# EAGLE schematic texboard (EAGLE 9.5.1)
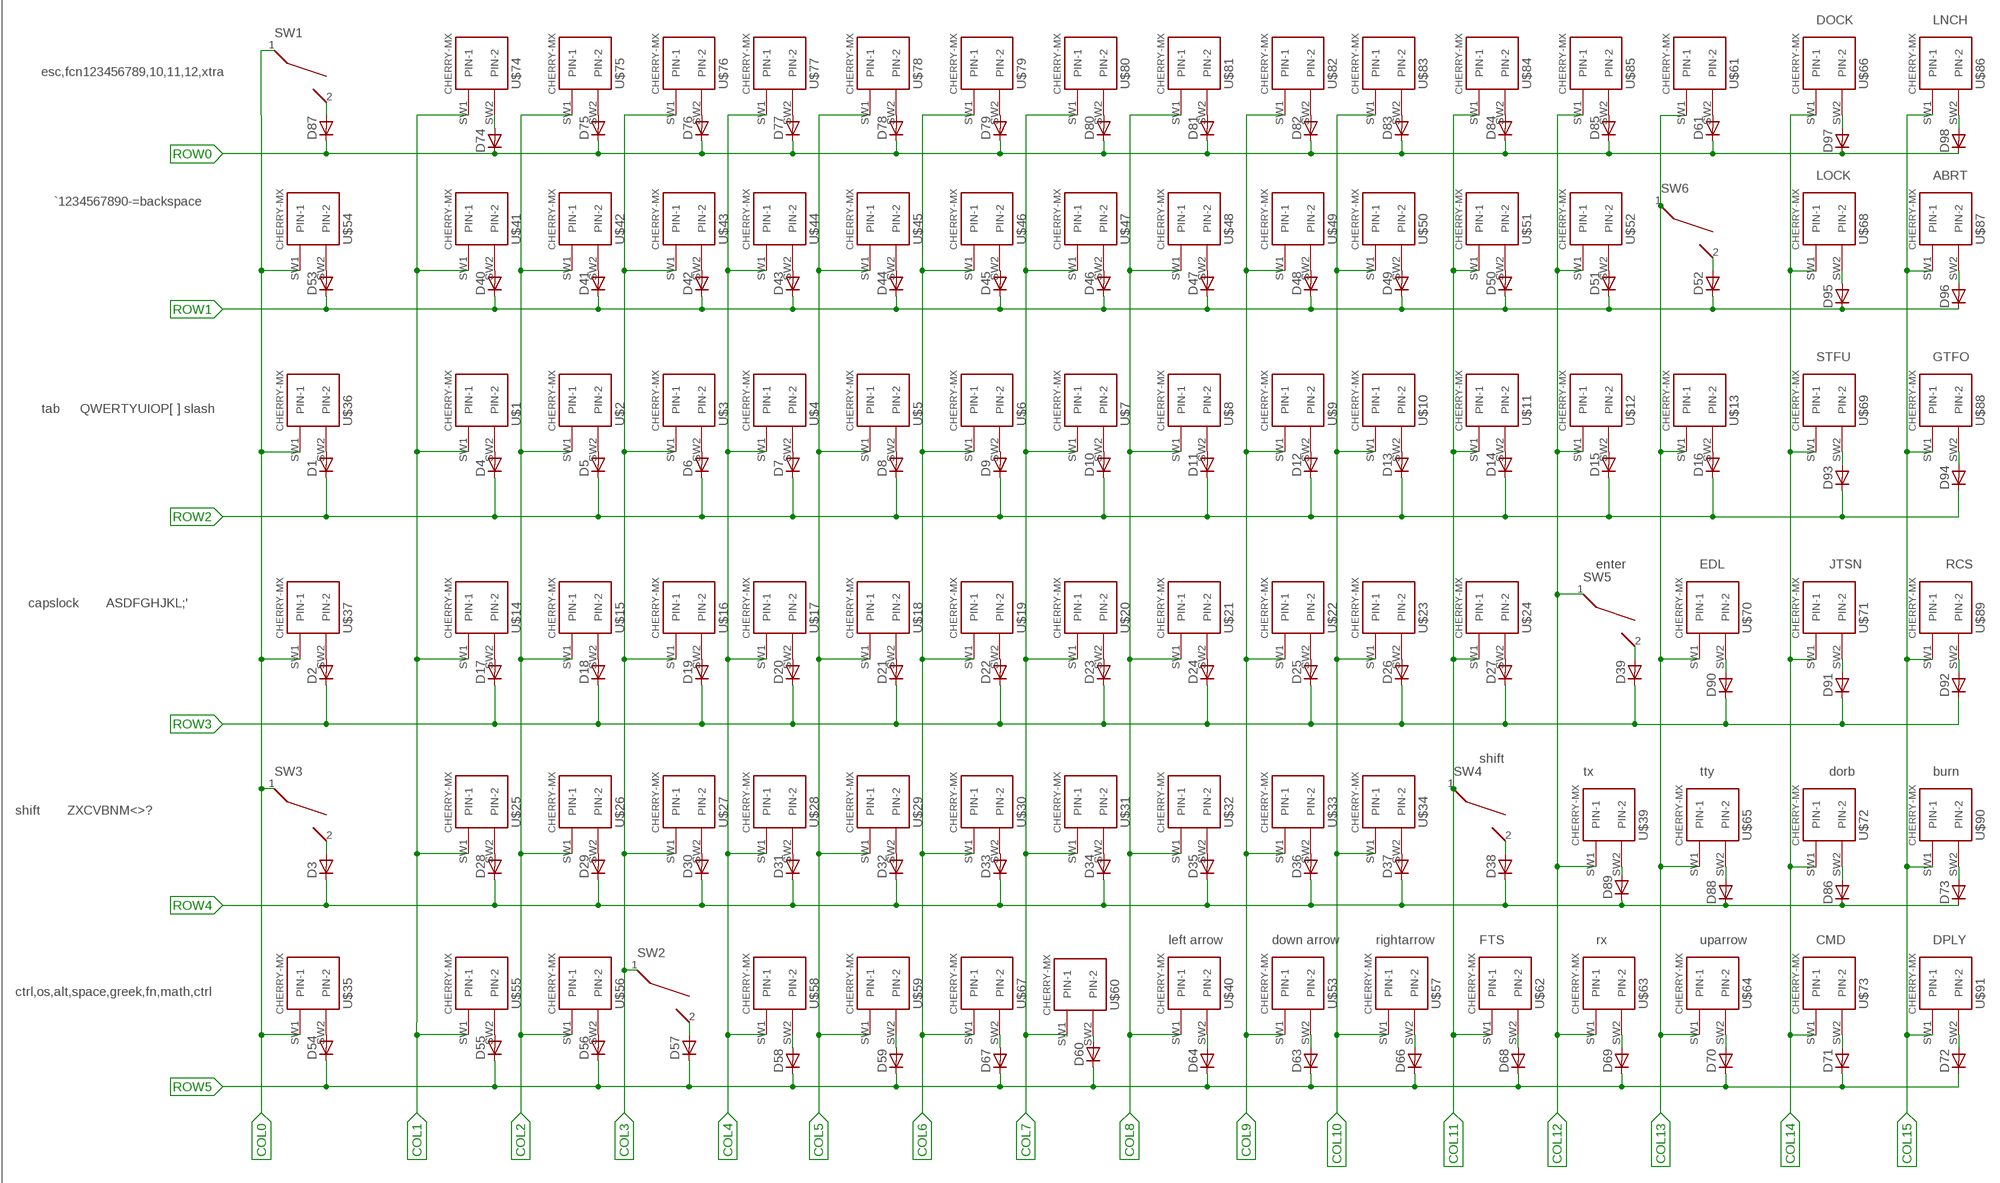
[diagram p0: schematic, sheet 1, part 1 of 2]
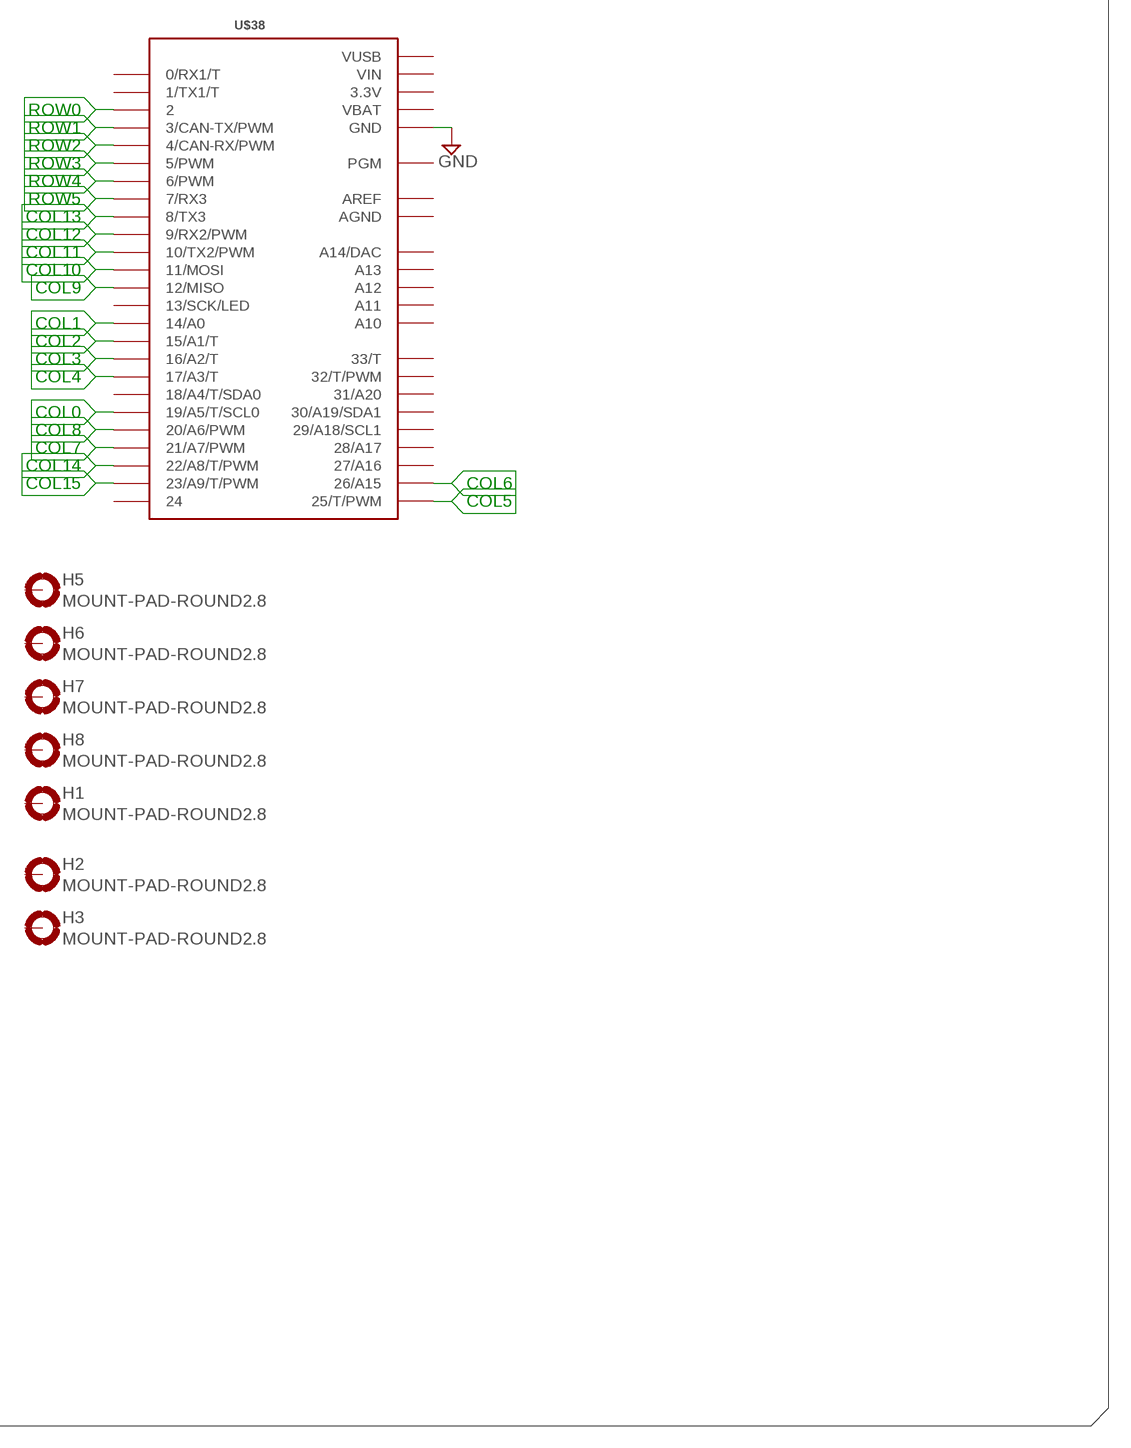
[diagram p1: schematic, sheet 1, part 2 of 2]

## Parts
D1  DIODE_E-DO35-7  [DIODE_DO35-7]
D2  DIODE_E-DO35-7  [DIODE_DO35-7]
D3  DIODE_E-DO35-7  [DIODE_DO35-7]
D4  DIODE_E-DO35-7  [DIODE_DO35-7]
D5  DIODE_E-DO35-7  [DIODE_DO35-7]
D6  DIODE_E-DO35-7  [DIODE_DO35-7]
D7  DIODE_E-DO35-7  [DIODE_DO35-7]
D8  DIODE_E-DO35-7  [DIODE_DO35-7]
D9  DIODE_E-DO35-7  [DIODE_DO35-7]
D10  DIODE_E-DO35-7  [DIODE_DO35-7]
D11  DIODE_E-DO35-7  [DIODE_DO35-7]
D12  DIODE_E-DO35-7  [DIODE_DO35-7]
D13  DIODE_E-DO35-7  [DIODE_DO35-7]
D14  DIODE_E-DO35-7  [DIODE_DO35-7]
D15  DIODE_E-DO35-7  [DIODE_DO35-7]
D16  DIODE_E-DO35-7  [DIODE_DO35-7]
D17  DIODE_E-DO35-7  [DIODE_DO35-7]
D18  DIODE_E-DO35-7  [DIODE_DO35-7]
D19  DIODE_E-DO35-7  [DIODE_DO35-7]
D20  DIODE_E-DO35-7  [DIODE_DO35-7]
D21  DIODE_E-DO35-7  [DIODE_DO35-7]
D22  DIODE_E-DO35-7  [DIODE_DO35-7]
D23  DIODE_E-DO35-7  [DIODE_DO35-7]
D24  DIODE_E-DO35-7  [DIODE_DO35-7]
D25  DIODE_E-DO35-7  [DIODE_DO35-7]
D26  DIODE_E-DO35-7  [DIODE_DO35-7]
D27  DIODE_E-DO35-7  [DIODE_DO35-7]
D28  DIODE_E-DO35-7  [DIODE_DO35-7]
D29  DIODE_E-DO35-7  [DIODE_DO35-7]
D30  DIODE_E-DO35-7  [DIODE_DO35-7]
D31  DIODE_E-DO35-7  [DIODE_DO35-7]
D32  DIODE_E-DO35-7  [DIODE_DO35-7]
D33  DIODE_E-DO35-7  [DIODE_DO35-7]
D34  DIODE_E-DO35-7  [DIODE_DO35-7]
D35  DIODE_E-DO35-7  [DIODE_DO35-7]
D36  DIODE_E-DO35-7  [DIODE_DO35-7]
D37  DIODE_E-DO35-7  [DIODE_DO35-7]
D38  DIODE_E-DO35-7  [DIODE_DO35-7]
D39  DIODE_E-DO35-7  [DIODE_DO35-7]
D40  DIODE_E-DO35-7  [DIODE_DO35-7]
D41  DIODE_E-DO35-7  [DIODE_DO35-7]
D42  DIODE_E-DO35-7  [DIODE_DO35-7]
D43  DIODE_E-DO35-7  [DIODE_DO35-7]
D44  DIODE_E-DO35-7  [DIODE_DO35-7]
D45  DIODE_E-DO35-7  [DIODE_DO35-7]
D46  DIODE_E-DO35-7  [DIODE_DO35-7]
D47  DIODE_E-DO35-7  [DIODE_DO35-7]
D48  DIODE_E-DO35-7  [DIODE_DO35-7]
D49  DIODE_E-DO35-7  [DIODE_DO35-7]
D50  DIODE_E-DO35-7  [DIODE_DO35-7]
D51  DIODE_E-DO35-7  [DIODE_DO35-7]
D52  DIODE_E-DO35-7  [DIODE_DO35-7]
D53  DIODE_E-DO35-7  [DIODE_DO35-7]
D54  DIODE_E-DO35-7  [DIODE_DO35-7]
D55  DIODE_E-DO35-7  [DIODE_DO35-7]
D56  DIODE_E-DO35-7  [DIODE_DO35-7]
D57  DIODE_E-DO35-7  [DIODE_DO35-7]
D58  DIODE_E-DO35-7  [DIODE_DO35-7]
D59  DIODE_E-DO35-7  [DIODE_DO35-7]
D60  DIODE_E-DO35-7  [DIODE_DO35-7]
D61  DIODE_E-DO35-7  [DIODE_DO35-7]
D63  DIODE_E-DO35-7  [DIODE_DO35-7]
D64  DIODE_E-DO35-7  [DIODE_DO35-7]
D66  DIODE_E-DO35-7  [DIODE_DO35-7]
D67  DIODE_E-DO35-7  [DIODE_DO35-7]
D68  DIODE_E-DO35-7  [DIODE_DO35-7]
D69  DIODE_E-DO35-7  [DIODE_DO35-7]
D70  DIODE_E-DO35-7  [DIODE_DO35-7]
D71  DIODE_E-DO35-7  [DIODE_DO35-7]
D72  DIODE_E-DO35-7  [DIODE_DO35-7]
D73  DIODE_E-DO35-7  [DIODE_DO35-7]
D74  DIODE_E-DO35-7  [DIODE_DO35-7]
D75  DIODE_E-DO35-7  [DIODE_DO35-7]
D76  DIODE_E-DO35-7  [DIODE_DO35-7]
D77  DIODE_E-DO35-7  [DIODE_DO35-7]
D78  DIODE_E-DO35-7  [DIODE_DO35-7]
D79  DIODE_E-DO35-7  [DIODE_DO35-7]
D80  DIODE_E-DO35-7  [DIODE_DO35-7]
D81  DIODE_E-DO35-7  [DIODE_DO35-7]
D82  DIODE_E-DO35-7  [DIODE_DO35-7]
D83  DIODE_E-DO35-7  [DIODE_DO35-7]
D84  DIODE_E-DO35-7  [DIODE_DO35-7]
D85  DIODE_E-DO35-7  [DIODE_DO35-7]
D86  DIODE_E-DO35-7  [DIODE_DO35-7]
D87  DIODE_E-DO35-7  [DIODE_DO35-7]
D88  DIODE_E-DO35-7  [DIODE_DO35-7]
D89  DIODE_E-DO35-7  [DIODE_DO35-7]
D90  DIODE_E-DO35-7  [DIODE_DO35-7]
D91  DIODE_E-DO35-7  [DIODE_DO35-7]
D92  DIODE_E-DO35-7  [DIODE_DO35-7]
D93  DIODE_E-DO35-7  [DIODE_DO35-7]
D94  DIODE_E-DO35-7  [DIODE_DO35-7]
D95  DIODE_E-DO35-7  [DIODE_DO35-7]
D96  DIODE_E-DO35-7  [DIODE_DO35-7]
D97  DIODE_E-DO35-7  [DIODE_DO35-7]
D98  DIODE_E-DO35-7  [DIODE_DO35-7]
H1  MOUNT-PAD-ROUND2.8  [2,8-PAD]
H2  MOUNT-PAD-ROUND2.8  [2,8-PAD]
H3  MOUNT-PAD-ROUND2.8  [2,8-PAD]
H5  MOUNT-PAD-ROUND2.8  [2,8-PAD]
H6  MOUNT-PAD-ROUND2.8  [2,8-PAD]
H7  MOUNT-PAD-ROUND2.8  [2,8-PAD]
H8  MOUNT-PAD-ROUND2.8  [2,8-PAD]
SW1  CHERRY_MX_STABILIZER_2X  [MX1A-XXNN_WITH_STABILIZER_2X]
SW2  CHERRY_MX_WITH_FIXING_PINS_&_STABILIZER_6.25X  [MX1A-XXNW_WITH_STABILIZER_6.25X]
SW3  CHERRY_MX_STABILIZER_2X  [MX1A-XXNN_WITH_STABILIZER_2X]
SW4  CHERRY_MX_STABILIZER_2X  [MX1A-XXNN_WITH_STABILIZER_2X]
SW5  CHERRY_MX_STABILIZER_2X  [MX1A-XXNN_WITH_STABILIZER_2X]
SW6  CHERRY_MX_STABILIZER_2X  [MX1A-XXNN_WITH_STABILIZER_2X]
U$1  CHERRY-MX  [CHERRY-MX]
U$2  CHERRY-MX  [CHERRY-MX]
U$3  CHERRY-MX  [CHERRY-MX]
U$4  CHERRY-MX  [CHERRY-MX]
U$5  CHERRY-MX  [CHERRY-MX]
U$6  CHERRY-MX  [CHERRY-MX]
U$7  CHERRY-MX  [CHERRY-MX]
U$8  CHERRY-MX  [CHERRY-MX]
U$9  CHERRY-MX  [CHERRY-MX]
U$10  CHERRY-MX  [CHERRY-MX]
U$11  CHERRY-MX  [CHERRY-MX]
U$12  CHERRY-MX  [CHERRY-MX]
U$13  CHERRY-MX  [CHERRY-MX]
U$14  CHERRY-MX  [CHERRY-MX]
U$15  CHERRY-MX  [CHERRY-MX]
U$16  CHERRY-MX  [CHERRY-MX]
U$17  CHERRY-MX  [CHERRY-MX]
U$18  CHERRY-MX  [CHERRY-MX]
U$19  CHERRY-MX  [CHERRY-MX]
U$20  CHERRY-MX  [CHERRY-MX]
U$21  CHERRY-MX  [CHERRY-MX]
U$22  CHERRY-MX  [CHERRY-MX]
U$23  CHERRY-MX  [CHERRY-MX]
U$24  CHERRY-MX  [CHERRY-MX]
U$25  CHERRY-MX  [CHERRY-MX]
U$26  CHERRY-MX  [CHERRY-MX]
U$27  CHERRY-MX  [CHERRY-MX]
U$28  CHERRY-MX  [CHERRY-MX]
U$29  CHERRY-MX  [CHERRY-MX]
U$30  CHERRY-MX  [CHERRY-MX]
U$31  CHERRY-MX  [CHERRY-MX]
U$32  CHERRY-MX  [CHERRY-MX]
U$33  CHERRY-MX  [CHERRY-MX]
U$34  CHERRY-MX  [CHERRY-MX]
U$35  CHERRY-MX  [CHERRY-MX]
U$36  CHERRY-MX  [CHERRY-MX]
U$37  CHERRY-MX  [CHERRY-MX]
U$38  TEENSY_3.1-3.2_ALL_PINS&PADS  [TEENSY_3.0-3.2_ALL_PINS_&_PADS]
U$39  CHERRY-MX  [CHERRY-MX]
U$40  CHERRY-MX  [CHERRY-MX]
U$41  CHERRY-MX  [CHERRY-MX]
U$42  CHERRY-MX  [CHERRY-MX]
U$43  CHERRY-MX  [CHERRY-MX]
U$44  CHERRY-MX  [CHERRY-MX]
U$45  CHERRY-MX  [CHERRY-MX]
U$46  CHERRY-MX  [CHERRY-MX]
U$47  CHERRY-MX  [CHERRY-MX]
U$48  CHERRY-MX  [CHERRY-MX]
U$49  CHERRY-MX  [CHERRY-MX]
U$50  CHERRY-MX  [CHERRY-MX]
U$51  CHERRY-MX  [CHERRY-MX]
U$52  CHERRY-MX  [CHERRY-MX]
U$53  CHERRY-MX  [CHERRY-MX]
U$54  CHERRY-MX  [CHERRY-MX]
U$55  CHERRY-MX  [CHERRY-MX]
U$56  CHERRY-MX  [CHERRY-MX]
U$57  CHERRY-MX  [CHERRY-MX]
U$58  CHERRY-MX  [CHERRY-MX]
U$59  CHERRY-MX  [CHERRY-MX]
U$60  CHERRY-MX  [CHERRY-MX]
U$61  CHERRY-MX  [CHERRY-MX]
U$62  CHERRY-MX  [CHERRY-MX]
U$63  CHERRY-MX  [CHERRY-MX]
U$64  CHERRY-MX  [CHERRY-MX]
U$65  CHERRY-MX  [CHERRY-MX]
U$66  CHERRY-MX  [CHERRY-MX]
U$67  CHERRY-MX  [CHERRY-MX]
U$68  CHERRY-MX  [CHERRY-MX]
U$69  CHERRY-MX  [CHERRY-MX]
U$70  CHERRY-MX  [CHERRY-MX]
U$71  CHERRY-MX  [CHERRY-MX]
U$72  CHERRY-MX  [CHERRY-MX]
U$73  CHERRY-MX  [CHERRY-MX]
U$74  CHERRY-MX  [CHERRY-MX]
U$75  CHERRY-MX  [CHERRY-MX]
U$76  CHERRY-MX  [CHERRY-MX]
U$77  CHERRY-MX  [CHERRY-MX]
U$78  CHERRY-MX  [CHERRY-MX]
U$79  CHERRY-MX  [CHERRY-MX]
U$80  CHERRY-MX  [CHERRY-MX]
U$81  CHERRY-MX  [CHERRY-MX]
U$82  CHERRY-MX  [CHERRY-MX]
U$83  CHERRY-MX  [CHERRY-MX]
U$84  CHERRY-MX  [CHERRY-MX]
U$85  CHERRY-MX  [CHERRY-MX]
U$86  CHERRY-MX  [CHERRY-MX]
U$87  CHERRY-MX  [CHERRY-MX]
U$88  CHERRY-MX  [CHERRY-MX]
U$89  CHERRY-MX  [CHERRY-MX]
U$90  CHERRY-MX  [CHERRY-MX]
U$91  CHERRY-MX  [CHERRY-MX]

## Nets
COL0: SW1.1 SW3.1 U$35.SW1(PIN-1) U$36.SW1(PIN-1) U$37.SW1(PIN-1) U$38.19/A5(19/A5/T/SCL0) U$54.SW1(PIN-1)
COL1: U$1.SW1(PIN-1) U$14.SW1(PIN-1) U$25.SW1(PIN-1) U$38.14/A0 U$41.SW1(PIN-1) U$55.SW1(PIN-1) U$74.SW1(PIN-1)
COL2: U$2.SW1(PIN-1) U$15.SW1(PIN-1) U$26.SW1(PIN-1) U$38.15/A1(15/A1/T) U$42.SW1(PIN-1) U$56.SW1(PIN-1) U$75.SW1(PIN-1)
COL3: SW2.1 U$3.SW1(PIN-1) U$16.SW1(PIN-1) U$27.SW1(PIN-1) U$38.16/A2(16/A2/T) U$43.SW1(PIN-1) U$76.SW1(PIN-1)
COL4: U$4.SW1(PIN-1) U$17.SW1(PIN-1) U$28.SW1(PIN-1) U$38.17/A3(17/A3/T) U$44.SW1(PIN-1) U$58.SW1(PIN-1) U$77.SW1(PIN-1)
COL5: U$5.SW1(PIN-1) U$18.SW1(PIN-1) U$29.SW1(PIN-1) U$38.25(25/T/PWM) U$45.SW1(PIN-1) U$59.SW1(PIN-1) U$78.SW1(PIN-1)
COL6: U$6.SW1(PIN-1) U$19.SW1(PIN-1) U$30.SW1(PIN-1) U$38.26(26/A15) U$46.SW1(PIN-1) U$67.SW1(PIN-1) U$79.SW1(PIN-1)
COL7: U$7.SW1(PIN-1) U$20.SW1(PIN-1) U$31.SW1(PIN-1) U$38.21/A7(21/A7/PWM) U$47.SW1(PIN-1) U$60.SW1(PIN-1) U$80.SW1(PIN-1)
COL8: U$8.SW1(PIN-1) U$21.SW1(PIN-1) U$32.SW1(PIN-1) U$38.20/A6(20/A6/PWM) U$40.SW1(PIN-1) U$48.SW1(PIN-1) U$81.SW1(PIN-1)
COL9: U$9.SW1(PIN-1) U$22.SW1(PIN-1) U$33.SW1(PIN-1) U$38.12(12/MISO) U$49.SW1(PIN-1) U$53.SW1(PIN-1) U$82.SW1(PIN-1)
COL10: U$10.SW1(PIN-1) U$23.SW1(PIN-1) U$34.SW1(PIN-1) U$38.11(11/MOSI) U$50.SW1(PIN-1) U$57.SW1(PIN-1) U$83.SW1(PIN-1)
COL11: SW4.1 U$11.SW1(PIN-1) U$24.SW1(PIN-1) U$38.10(10/TX2/PWM) U$51.SW1(PIN-1) U$62.SW1(PIN-1) U$84.SW1(PIN-1)
COL12: SW5.1 U$12.SW1(PIN-1) U$38.9(9/RX2/PWM) U$39.SW1(PIN-1) U$52.SW1(PIN-1) U$63.SW1(PIN-1) U$85.SW1(PIN-1)
COL13: SW6.1 U$13.SW1(PIN-1) U$38.8(8/TX3) U$61.SW1(PIN-1) U$64.SW1(PIN-1) U$65.SW1(PIN-1) U$70.SW1(PIN-1)
COL14: U$38.22/A8(22/A8/T/PWM) U$66.SW1(PIN-1) U$68.SW1(PIN-1) U$69.SW1(PIN-1) U$71.SW1(PIN-1) U$72.SW1(PIN-1) U$73.SW1(PIN-1)
COL15: U$38.23/A9(23/A9/T/PWM) U$86.SW1(PIN-1) U$87.SW1(PIN-1) U$88.SW1(PIN-1) U$89.SW1(PIN-1) U$90.SW1(PIN-1) U$91.SW1(PIN-1)
GND: U$38.GND U$38.GND1(GND) U$38.GND2(GND)
N$1: D4.A(C) U$1.SW2(PIN-2)
N$2: D5.A(C) U$2.SW2(PIN-2)
N$3: D6.A(C) U$3.SW2(PIN-2)
N$4: D7.A(C) U$4.SW2(PIN-2)
N$5: D8.A(C) U$5.SW2(PIN-2)
N$6: D9.A(C) U$6.SW2(PIN-2)
N$7: D10.A(C) U$7.SW2(PIN-2)
N$8: D11.A(C) U$8.SW2(PIN-2)
N$9: D12.A(C) U$9.SW2(PIN-2)
N$10: D13.A(C) U$10.SW2(PIN-2)
N$11: D14.A(C) U$11.SW2(PIN-2)
N$12: D15.A(C) U$12.SW2(PIN-2)
N$13: D16.A(C) U$13.SW2(PIN-2)
N$14: D17.A(C) U$14.SW2(PIN-2)
N$15: D18.A(C) U$15.SW2(PIN-2)
N$16: D19.A(C) U$16.SW2(PIN-2)
N$17: D20.A(C) U$17.SW2(PIN-2)
N$18: D21.A(C) U$18.SW2(PIN-2)
N$19: D22.A(C) U$19.SW2(PIN-2)
N$20: D23.A(C) U$20.SW2(PIN-2)
N$21: D24.A(C) U$21.SW2(PIN-2)
N$22: D25.A(C) U$22.SW2(PIN-2)
N$23: D26.A(C) U$23.SW2(PIN-2)
N$24: D27.A(C) U$24.SW2(PIN-2)
N$25: D28.A(C) U$25.SW2(PIN-2)
N$26: D29.A(C) U$26.SW2(PIN-2)
N$27: D30.A(C) U$27.SW2(PIN-2)
N$28: D31.A(C) U$28.SW2(PIN-2)
N$29: D32.A(C) U$29.SW2(PIN-2)
N$30: D33.A(C) U$30.SW2(PIN-2)
N$31: D34.A(C) U$31.SW2(PIN-2)
N$32: D35.A(C) U$32.SW2(PIN-2)
N$33: D36.A(C) U$33.SW2(PIN-2)
N$34: D37.A(C) U$34.SW2(PIN-2)
N$35: D60.A(C) U$60.SW2(PIN-2)
N$36: D61.A(C) U$61.SW2(PIN-2)
N$39: D57.A(C) SW2.2
N$40: D97.A(C) U$66.SW2(PIN-2)
N$41: D67.A(C) U$67.SW2(PIN-2)
N$42: D98.A(C) U$86.SW2(PIN-2)
N$44: D87.A(C) SW1.2
N$46: D69.A(C) U$63.SW2(PIN-2)
N$47: D68.A(C) U$62.SW2(PIN-2)
N$48: D66.A(C) U$57.SW2(PIN-2)
N$49: D63.A(C) U$53.SW2(PIN-2)
N$50: D64.A(C) U$40.SW2(PIN-2)
N$51: D1.A(C) U$36.SW2(PIN-2)
N$52: D2.A(C) U$37.SW2(PIN-2)
N$53: D3.A(C) SW3.2
N$54: D38.A(C) SW4.2
N$55: D39.A(C) SW5.2
N$56: D40.A(C) U$41.SW2(PIN-2)
N$57: D41.A(C) U$42.SW2(PIN-2)
N$58: D42.A(C) U$43.SW2(PIN-2)
N$59: D43.A(C) U$44.SW2(PIN-2)
N$60: D44.A(C) U$45.SW2(PIN-2)
N$61: D45.A(C) U$46.SW2(PIN-2)
N$62: D46.A(C) U$47.SW2(PIN-2)
N$63: D47.A(C) U$48.SW2(PIN-2)
N$64: D48.A(C) U$49.SW2(PIN-2)
N$65: D49.A(C) U$50.SW2(PIN-2)
N$66: D50.A(C) U$51.SW2(PIN-2)
N$67: D51.A(C) U$52.SW2(PIN-2)
N$68: D52.A(C) SW6.2
N$70: D54.A(C) U$35.SW2(PIN-2)
N$71: D55.A(C) U$55.SW2(PIN-2)
N$72: D56.A(C) U$56.SW2(PIN-2)
N$73: D70.A(C) U$64.SW2(PIN-2)
N$74: D58.A(C) U$58.SW2(PIN-2)
N$75: D59.A(C) U$59.SW2(PIN-2)
N$76: D71.A(C) U$73.SW2(PIN-2)
N$77: D72.A(C) U$91.SW2(PIN-2)
N$78: D89.A(C) U$39.SW2(PIN-2)
N$79: D88.A(C) U$65.SW2(PIN-2)
N$80: D86.A(C) U$72.SW2(PIN-2)
N$81: D73.A(C) U$90.SW2(PIN-2)
N$82: D91.A(C) U$71.SW2(PIN-2)
N$83: D53.A(C) U$54.SW2(PIN-2)
N$84: D92.A(C) U$89.SW2(PIN-2)
N$91: D90.A(C) U$70.SW2(PIN-2)
N$92: D94.A(C) U$88.SW2(PIN-2)
N$93: D93.A(C) U$69.SW2(PIN-2)
N$95: D95.A(C) U$68.SW2(PIN-2)
N$96: D96.A(C) U$87.SW2(PIN-2)
N$119: D74.A(C) U$74.SW2(PIN-2)
N$120: D75.A(C) U$75.SW2(PIN-2)
N$121: D76.A(C) U$76.SW2(PIN-2)
N$122: D77.A(C) U$77.SW2(PIN-2)
N$123: D78.A(C) U$78.SW2(PIN-2)
N$124: D79.A(C) U$79.SW2(PIN-2)
N$125: D80.A(C) U$80.SW2(PIN-2)
N$126: D81.A(C) U$81.SW2(PIN-2)
N$127: D82.A(C) U$82.SW2(PIN-2)
N$128: D83.A(C) U$83.SW2(PIN-2)
N$129: D84.A(C) U$84.SW2(PIN-2)
N$130: D85.A(C) U$85.SW2(PIN-2)
ROW0: D61.C(A) D74.C(A) D75.C(A) D76.C(A) D77.C(A) D78.C(A) D79.C(A) D80.C(A) D81.C(A) D82.C(A) D83.C(A) D84.C(A) D85.C(A) D87.C(A) D97.C(A) D98.C(A) U$38.2
ROW1: D40.C(A) D41.C(A) D42.C(A) D43.C(A) D44.C(A) D45.C(A) D46.C(A) D47.C(A) D48.C(A) D49.C(A) D50.C(A) D51.C(A) D52.C(A) D53.C(A) D95.C(A) D96.C(A) U$38.3(3/CAN-TX/PWM)
ROW2: D1.C(A) D4.C(A) D5.C(A) D6.C(A) D7.C(A) D8.C(A) D9.C(A) D10.C(A) D11.C(A) D12.C(A) D13.C(A) D14.C(A) D15.C(A) D16.C(A) D93.C(A) D94.C(A) U$38.4(4/CAN-RX/PWM)
ROW3: D2.C(A) D17.C(A) D18.C(A) D19.C(A) D20.C(A) D21.C(A) D22.C(A) D23.C(A) D24.C(A) D25.C(A) D26.C(A) D27.C(A) D39.C(A) D90.C(A) D91.C(A) D92.C(A) U$38.5(5/PWM)
ROW4: D3.C(A) D28.C(A) D29.C(A) D30.C(A) D31.C(A) D32.C(A) D33.C(A) D34.C(A) D35.C(A) D36.C(A) D37.C(A) D38.C(A) D73.C(A) D86.C(A) D88.C(A) D89.C(A) U$38.6(6/PWM)
ROW5: D54.C(A) D55.C(A) D56.C(A) D57.C(A) D58.C(A) D59.C(A) D60.C(A) D63.C(A) D64.C(A) D66.C(A) D67.C(A) D68.C(A) D69.C(A) D70.C(A) D71.C(A) D72.C(A) U$38.7(7/RX3)
Unconnected: H1.B2,8(MOUNT) H2.B2,8(MOUNT) H3.B2,8(MOUNT) H5.B2,8(MOUNT) H6.B2,8(MOUNT) H7.B2,8(MOUNT) H8.B2,8(MOUNT) U$38.0(0/RX1/T) U$38.1(1/TX1/T) U$38.13(13/SCK/LED) U$38.18/A4(18/A4/T/SDA0) U$38.24 U$38.27(27/A16) U$38.28(28/A17) U$38.29(29/A18/SCL1) U$38.30(30/A19/SDA1) U$38.31(31/A20) U$38.32(32/T/PWM) U$38.33(33/T) U$38.A10 U$38.A11 U$38.A12 U$38.A13 U$38.PGM U$38.RESET/DAC(A14/DAC)

## Notes on the sheet
- DOCK | LNCH
- esc,fcn123456789,10,11,12,xtra
- LOCK | ABRT
- `1234567890-=backspace
- STFU | GTFO
- tab | QWERTYUIOP[ ] slash
- enter | EDL | JTSN | RCS
- capslock | ASDFGHJKL;'
- shift
- tx | tty | dorb | burn
- shift | ZXCVBNM<>?
- left arrow | down arrow | rightarrow | FTS | rx | uparrow | CMD | DPLY
- ctrl,os,alt,space,greek,fn,math,ctrl

## Power pins joined to a net without a drawn wire
3.3V: U$38.3.3V U$38.3.3V1(3.3V) U$38.3.3V2(3.3V)
AGND: U$38.AGND
AREF: U$38.AREF
VBAT: U$38.VBAT
VIN: U$38.VIN
VUSB: U$38.VUSB

## Library data of the parts
D1-D61 D63 D64 D66-D98 = eagle-ltspice:DIODE_E-: Schottky Diode; SPICEMODEL: diode; SPICEPREFIX: D
H1-H3 H5-H8 = holes:MOUNT-PAD-ROUND: MOUNTING PAD, round
SW1-SW6 = Cherry_MX_v7.0:CHERRY_MX
U$1-U$37 U$39-U$91 = cherrymx:CHERRY-MX: Cherry MX series keyswitch
U$38 = Teensy_3_and_LC_Series_Boards_v1.4:TEENSY_3.1-3.2_ALL_PINS&PADS: Footprint for Teensy 3.1 or 3.2 board using all pads and all through-holes. Pads need a 2x7 0.1" SMD header.